# EAGLE schematic BRAIN (EAGLE 7.5.0)
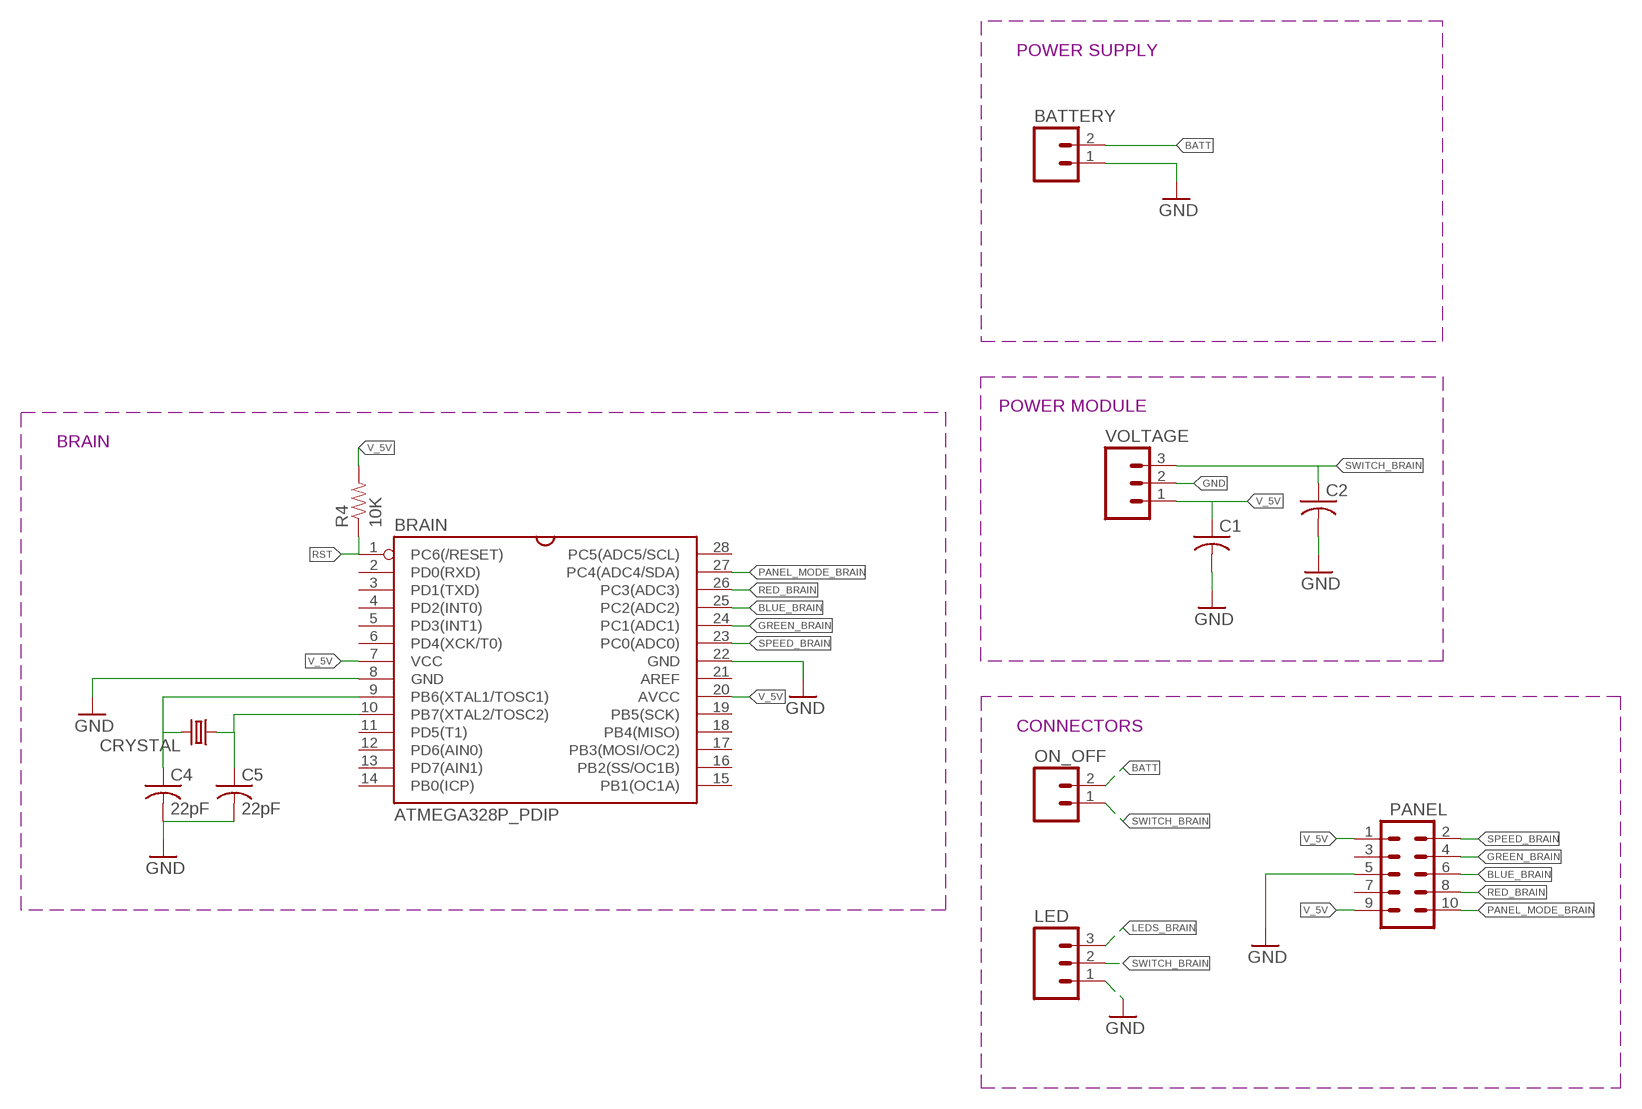
[diagram p0: schematic, sheet 1]

## Parts
BATTERY  M02PTH  [1X02]
BRAIN  ATMEGA328P_PDIP  [DIL-28-3]
C1  C-US025-025X050  [C025-025X050]
C2  C-US025-025X050  [C025-025X050]
C4  22pF  C-US025-024X044  [C025-024X044]
C5  22pF  C-US025-024X044  [C025-024X044]
CRYSTAL  CRYSTALHC49US  [HC49US]
LED  M03JST-PTH  [JST-3-PTH]
ON_OFF  M02-JST-2-PTH-NO_SILK  [JST-2-PTH-NS]
PANEL  M05X2SHD  [2X5-SHROUDED]
R4  10K  RESISTOR1206  [1206]
VOLTAGE  M03PTH  [1X03]

## Nets
BATT: BATTERY.2 ON_OFF.2
BLUE_BRAIN: BRAIN.25(PC2(ADC2)) PANEL.6
GND: BATTERY.1 BRAIN.8(GND) BRAIN.22(GND) C1.2 C2.2 C4.2 C5.2 LED.1 PANEL.5 VOLTAGE.2
GREEN_BRAIN: BRAIN.24(PC1(ADC1)) PANEL.4
LEDS_BRAIN: LED.3
N$7: BRAIN.9(PB6(XTAL1/TOSC1)) C4.1 CRYSTAL.2
N$8: BRAIN.10(PB7(XTAL2/TOSC2)) C5.1 CRYSTAL.1
PANEL_MODE_BRAIN: BRAIN.27(PC4(ADC4/SDA)) PANEL.10
RED_BRAIN: BRAIN.26(PC3(ADC3)) PANEL.8
RST: BRAIN.1(PC6(/RESET)) R4.1
SPEED_BRAIN: BRAIN.23(PC0(ADC0)) PANEL.2
SWITCH_BRAIN: C2.1 LED.2 ON_OFF.1 VOLTAGE.3
V_5V: BRAIN.7(VCC) BRAIN.20(AVCC) C1.1 PANEL.1 PANEL.9 R4.2 VOLTAGE.1
Unconnected: BRAIN.2(PD0(RXD)) BRAIN.3(PD1(TXD)) BRAIN.4(PD2(INT0)) BRAIN.5(PD3(INT1)) BRAIN.6(PD4(XCK/T0)) BRAIN.11(PD5(T1)) BRAIN.12(PD6(AIN0)) BRAIN.13(PD7(AIN1)) BRAIN.14(PB0(ICP)) BRAIN.15(PB1(OC1A)) BRAIN.16(PB2(SS/OC1B)) BRAIN.17(PB3(MOSI/OC2)) BRAIN.18(PB4(MISO)) BRAIN.19(PB5(SCK)) BRAIN.21(AREF) BRAIN.28(PC5(ADC5/SCL)) PANEL.3 PANEL.7

## Notes on the sheet
- POWER SUPPLY
- POWER MODULE
- BRAIN
- CONNECTORS

## Library data of the parts
BATTERY ON_OFF = SparkFun-Connectors:M02: Standard 2-pin 0.1" header. Use with - straight break away headers ( PRT-00116) - right angle break away headers (PRT-00553) - swiss pins (PRT-00743) - machine pins (PRT-00117) - female headers (PRT-00115) Molex polarized connector foot print use with: PRT-08233 with associated crimp pins and housings. 2.54_SCREWTERM for use with PRT-10571. 3.5mm Screw Terminal footprints for PRT-08084 5mm Screw Terminal footprints for use with PRT-08432
BRAIN = RodrigoMarques_Parts:ATMEGA328P_PDIP: uC used in the Arduino 32kb flash, 1k EEPROM, 2k SRAM This is the through-hole version of this chip.
C1 C2 C4 C5 = adafruit:C-US: CAPACITOR, American symbol
CRYSTAL = SparkFun-FreqCtrl:CRYSTAL: Various standard crystals. Proven footprints.
LED = SparkFun-Connectors:M03: Header 3 Standard 3-pin 0.1" header. Use with straight break away headers (SKU : PRT-00116), right angle break away headers (PRT-00553), swiss pins (PRT-00743), machine pins (PRT-00117), and female headers (PRT-00115). Molex polarized connector foot print use with SKU : PRT-08232 with associated crimp pins and housings.; SKU: PRT-09915
PANEL = SparkFun-Connectors:M05X2: Header 5x2 Standard 10-pin dual row 0.1" header. Commonly used with AVR-ISP. Use with Spark Fun Electronics SKU: PRT-00778
R4 = SparkFun-Resistors:RESISTOR: Resistor Basic schematic elements and footprints for 0603, 1206, and PTH resistors.
VOLTAGE = SparkFun-Connectors:M03: Header 3 Standard 3-pin 0.1" header. Use with straight break away headers (SKU : PRT-00116), right angle break away headers (PRT-00553), swiss pins (PRT-00743), machine pins (PRT-00117), and female headers (PRT-00115). Molex polarized connector foot print use with SKU : PRT-08232 with associated crimp pins and housings.

## Net classes
0 default: width 0.254 mm